# EAGLE schematic walle (EAGLE 7.6.0)
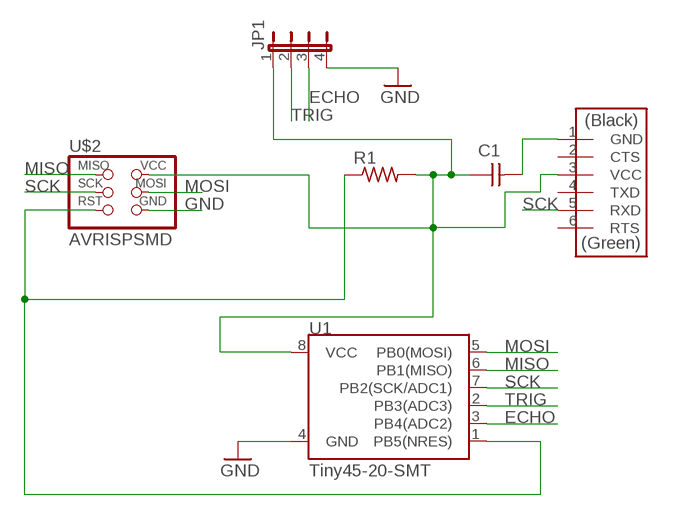
[diagram p0: schematic, sheet 1]

## Parts
C1  CAP-UNPOLARIZED  [C1206]
JP1  JP4E  [JP4]
R1  RES-US1206  [R1206]
U1  Tiny45-20-SMT  ATTINY45TINY45-20-SMT  [SO08-EIAJ]
U$2  AVRISPSMD  [2X03SMD]
U$3  FTDI-SMD-HEADER  [1X06SMD]

## Nets
ECHO: JP1.3 U1.3(PB4(ADC2))
GND: JP1.4 U1.4(GND) U$2.6(GND)
MISO: U1.6(PB1(MISO)) U$2.1(MISO)
MOSI: U1.5(PB0(MOSI)) U$2.4(MOSI)
N$1: C1.1 JP1.1 R1.2 U1.8(VCC) U$2.2(VCC) U$3.3(VCC)
N$3: C1.2 U$3.1(GND)
PB5: R1.1 U1.1(PB5(NRES)) U$2.5(RST)
SCK: U1.7(PB2(SCK/ADC1)) U$2.3(SCK) U$3.5(RXD)
TRIG: JP1.2 U1.2(PB3(ADC3))
Unconnected: U$3.2(CTS) U$3.4(TXD) U$3.6(RTS)

## Library data of the parts
C1 = fab:CAP-UNPOLARIZED
JP1 = jumper:JP4E: JUMPER
R1 = fab:RES-US: Resistor (US Symbol) Variants with postfix FAB are widened to allow the routing of internal traces
U1 = SparkFun-DigitalIC:ATTINY45: Atmel 8-pin 2/4/8kB flash uC; PROD_ID: IC-08922
U$2 = fab:AVRISP
U$3 = fab:FTDI-SMD-HEADER